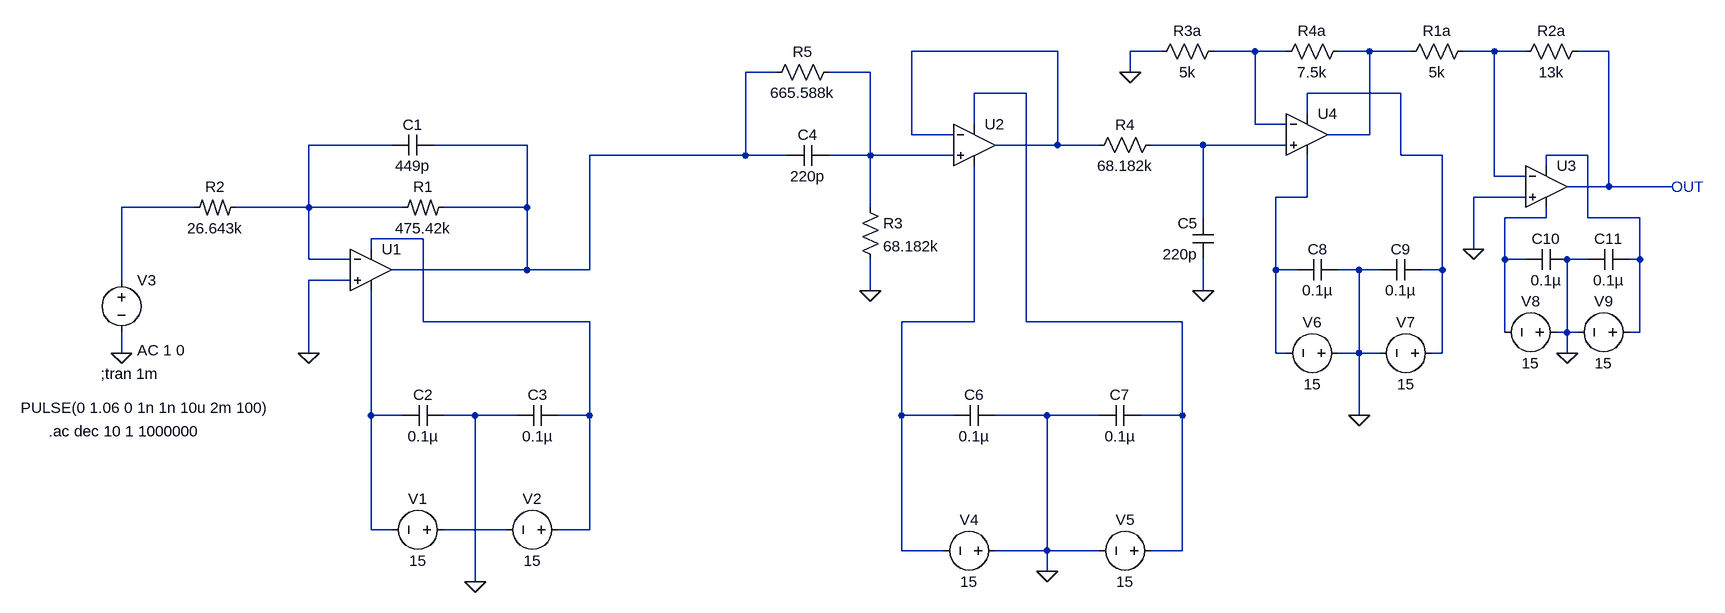
[diagram p0: schematic 4.asc]
4.asc, the LTspice schematic file:
Version 4
SHEET 1 880 680
WIRE -272 -304 -496 -304
WIRE -112 -304 -160 -304
WIRE 32 -304 -32 -304
WIRE 80 -304 32 -304
WIRE 208 -304 160 -304
WIRE 272 -304 208 -304
WIRE 400 -304 352 -304
WIRE 448 -304 400 -304
WIRE 576 -304 528 -304
WIRE -704 -272 -752 -272
WIRE -560 -272 -624 -272
WIRE -160 -272 -160 -304
WIRE -320 -240 -400 -240
WIRE 256 -240 112 -240
WIRE 112 -208 112 -240
WIRE -400 -192 -400 -240
WIRE 32 -192 32 -304
WIRE 80 -192 32 -192
WIRE -496 -176 -496 -304
WIRE -432 -176 -496 -176
WIRE 208 -176 208 -304
WIRE 208 -176 144 -176
WIRE -1296 -160 -1424 -160
WIRE -1088 -160 -1232 -160
WIRE -272 -160 -272 -304
WIRE -272 -160 -368 -160
WIRE -208 -160 -272 -160
WIRE -48 -160 -128 -160
WIRE 80 -160 -48 -160
WIRE -752 -144 -752 -272
WIRE -752 -144 -992 -144
WIRE -688 -144 -752 -144
WIRE -560 -144 -560 -272
WIRE -560 -144 -624 -144
WIRE -432 -144 -560 -144
WIRE 256 -144 256 -240
WIRE 320 -144 256 -144
WIRE 544 -144 480 -144
WIRE 480 -128 480 -144
WIRE 400 -112 400 -304
WIRE 448 -112 400 -112
WIRE 576 -96 576 -304
WIRE 576 -96 512 -96
WIRE 672 -96 576 -96
WIRE 112 -80 112 -144
WIRE 112 -80 64 -80
WIRE 448 -80 368 -80
WIRE -1600 -64 -1712 -64
WIRE -1424 -64 -1424 -160
WIRE -1424 -64 -1536 -64
WIRE -1280 -64 -1424 -64
WIRE -1088 -64 -1088 -160
WIRE -1088 -64 -1216 -64
WIRE -560 -64 -560 -144
WIRE -48 -48 -48 -160
WIRE 480 -48 480 -64
WIRE 480 -48 416 -48
WIRE 544 -48 544 -144
WIRE 624 -48 544 -48
WIRE -1248 -16 -1328 -16
WIRE -1328 0 -1328 -16
WIRE 368 0 368 -80
WIRE -1424 16 -1424 -64
WIRE -1360 16 -1424 16
WIRE 416 16 416 -48
WIRE 448 16 416 16
WIRE 544 16 512 16
WIRE 624 16 624 -48
WIRE 624 16 608 16
WIRE -1088 32 -1088 -64
WIRE -1088 32 -1296 32
WIRE -992 32 -992 -144
WIRE -992 32 -1088 32
WIRE 64 32 64 -80
WIRE 96 32 64 32
WIRE 192 32 160 32
WIRE 224 32 192 32
WIRE 320 32 320 -144
WIRE 320 32 288 32
WIRE -1712 48 -1712 -64
WIRE -1360 48 -1424 48
WIRE -560 64 -560 16
WIRE -48 64 -48 16
WIRE -1248 112 -1248 -16
WIRE -992 112 -1248 112
WIRE -400 112 -400 -128
WIRE -400 112 -512 112
WIRE -320 112 -320 -240
WIRE -80 112 -320 112
WIRE 416 128 416 16
WIRE 512 128 512 16
WIRE 512 128 496 128
WIRE 528 128 512 128
WIRE 624 128 624 16
WIRE 624 128 608 128
WIRE -1712 160 -1712 128
WIRE -1424 160 -1424 48
WIRE 64 160 64 32
WIRE 80 160 64 160
WIRE 192 160 192 32
WIRE 192 160 160 160
WIRE 224 160 192 160
WIRE 320 160 320 32
WIRE 320 160 304 160
WIRE 512 160 512 128
WIRE -1328 256 -1328 64
WIRE -1280 256 -1328 256
WIRE -1168 256 -1216 256
WIRE -1104 256 -1168 256
WIRE -992 256 -992 112
WIRE -992 256 -1040 256
WIRE -512 256 -512 112
WIRE -432 256 -512 256
WIRE -288 256 -368 256
WIRE -208 256 -288 256
WIRE -80 256 -80 112
WIRE -80 256 -144 256
WIRE 192 256 192 160
WIRE -1328 432 -1328 256
WIRE -1296 432 -1328 432
WIRE -1120 432 -1216 432
WIRE -992 432 -992 256
WIRE -992 432 -1040 432
WIRE -512 464 -512 256
WIRE -448 464 -512 464
WIRE -288 464 -288 256
WIRE -288 464 -368 464
WIRE -208 464 -288 464
WIRE -80 464 -80 256
WIRE -80 464 -128 464
WIRE -288 496 -288 464
WIRE -1168 512 -1168 256
FLAG -1712 160 0
FLAG -1424 160 0
FLAG -1168 512 0
FLAG -288 496 0
FLAG -560 64 0
FLAG -48 64 0
FLAG -160 -272 0
FLAG 368 0 0
FLAG 192 256 0
FLAG 512 160 0
SYMBOL Opamps\\UniversalOpamp2 -1328 32 R0
SYMATTR InstName U1
SYMATTR Value2 Avol=0.1Meg GBW=4Meg Slew=13Meg
SYMATTR SpiceLine2 en=0 enk=0 in=0 ink=0 Rin=1T
SYMBOL cap -1232 -176 R90
WINDOW 0 0 32 VBottom 2
WINDOW 3 32 32 VTop 2
SYMATTR InstName C1
SYMATTR Value 449p
SYMBOL res2 -1216 -80 R90
WINDOW 0 0 32 VBottom 2
WINDOW 3 32 32 VTop 2
SYMATTR InstName R1
SYMATTR Value 475.42k
SYMBOL res2 -1536 -80 R90
WINDOW 0 0 32 VBottom 2
WINDOW 3 32 32 VTop 2
SYMATTR InstName R2
SYMATTR Value 26.643k
SYMBOL cap -1216 240 R90
WINDOW 0 0 32 VBottom 2
WINDOW 3 32 32 VTop 2
SYMATTR InstName C2
SYMATTR Value 0.1µ
SYMBOL cap -1040 240 R90
WINDOW 0 0 32 VBottom 2
WINDOW 3 32 32 VTop 2
SYMATTR InstName C3
SYMATTR Value 0.1µ
SYMBOL voltage -1200 432 R90
WINDOW 0 -32 56 VBottom 2
WINDOW 3 32 56 VTop 2
WINDOW 123 0 0 Left 0
WINDOW 39 0 0 Left 0
SYMATTR InstName V1
SYMATTR Value 15
SYMBOL voltage -1024 432 R90
WINDOW 0 -32 56 VBottom 2
WINDOW 3 32 56 VTop 2
WINDOW 123 0 0 Left 0
WINDOW 39 0 0 Left 0
SYMATTR InstName V2
SYMATTR Value 15
SYMBOL voltage -1712 32 R0
WINDOW 123 24 124 Left 2
WINDOW 39 0 0 Left 0
WINDOW 3 -155 212 Left 2
SYMATTR Value2 AC 1 0
SYMATTR Value PULSE(0 1.06 0 1n 1n 10u 2m 100)
SYMATTR InstName V3
SYMBOL cap -624 -160 R90
WINDOW 0 0 32 VBottom 2
WINDOW 3 32 32 VTop 2
SYMATTR InstName C4
SYMATTR Value 220p
SYMBOL cap -32 16 R180
WINDOW 0 24 56 Left 2
WINDOW 3 24 8 Left 2
SYMATTR InstName C5
SYMATTR Value 220p
SYMBOL res -576 -80 R0
SYMATTR InstName R3
SYMATTR Value 68.182k
SYMBOL res -112 -176 R90
WINDOW 0 0 56 VBottom 2
WINDOW 3 32 56 VTop 2
SYMATTR InstName R4
SYMATTR Value 68.182k
SYMBOL Opamps\\UniversalOpamp2 -400 -160 R0
SYMATTR InstName U2
SYMATTR Value2 Avol=0.1Meg GBW=4Meg Slew=13Meg
SYMATTR SpiceLine2 en=0 enk=0 in=0 ink=0 Rin=1T
SYMBOL cap -368 240 R90
WINDOW 0 0 32 VBottom 2
WINDOW 3 32 32 VTop 2
SYMATTR InstName C6
SYMATTR Value 0.1µ
SYMBOL voltage -352 464 R90
WINDOW 0 -32 56 VBottom 2
WINDOW 3 32 56 VTop 2
WINDOW 123 0 0 Left 0
WINDOW 39 0 0 Left 0
SYMATTR InstName V4
SYMATTR Value 15
SYMBOL voltage -112 464 R90
WINDOW 0 -32 56 VBottom 2
WINDOW 3 32 56 VTop 2
WINDOW 123 0 0 Left 0
WINDOW 39 0 0 Left 0
SYMATTR InstName V5
SYMATTR Value 15
SYMBOL cap -144 240 R90
WINDOW 0 0 32 VBottom 2
WINDOW 3 32 32 VTop 2
SYMATTR InstName C7
SYMATTR Value 0.1µ
SYMBOL res -608 -288 R90
WINDOW 0 0 56 VBottom 2
WINDOW 3 32 56 VTop 2
SYMATTR InstName R5
SYMATTR Value 665.588k
SYMBOL Opamps\\UniversalOpamp2 112 -176 R0
SYMATTR InstName U4
SYMATTR Value2 Avol=0.1Meg GBW=4Meg Slew=13Meg
SYMATTR SpiceLine2 en=0 enk=0 in=0 ink=0 Rin=1T
SYMBOL res -16 -320 R90
WINDOW 0 0 56 VBottom 2
WINDOW 3 32 56 VTop 2
SYMATTR InstName R3a
SYMATTR Value 5k
SYMBOL res 176 -320 R90
WINDOW 0 0 56 VBottom 2
WINDOW 3 32 56 VTop 2
SYMATTR InstName R4a
SYMATTR Value 7.5k
SYMBOL res 368 -320 R90
WINDOW 0 0 56 VBottom 2
WINDOW 3 32 56 VTop 2
SYMATTR InstName R1a
SYMATTR Value 5k
SYMBOL res 544 -320 R90
WINDOW 0 0 56 VBottom 2
WINDOW 3 32 56 VTop 2
SYMATTR InstName R2a
SYMATTR Value 13k
SYMBOL Opamps\\UniversalOpamp2 480 -96 R0
SYMATTR InstName U3
SYMATTR Value2 Avol=0.1Meg GBW=4Meg Slew=13Meg
SYMATTR SpiceLine2 en=0 enk=0 in=0 ink=0 Rin=1T
SYMBOL cap 160 16 R90
WINDOW 0 0 32 VBottom 2
WINDOW 3 32 32 VTop 2
SYMATTR InstName C8
SYMATTR Value 0.1µ
SYMBOL cap 288 16 R90
WINDOW 0 0 32 VBottom 2
WINDOW 3 32 32 VTop 2
SYMATTR InstName C9
SYMATTR Value 0.1µ
SYMBOL voltage 176 160 R90
WINDOW 0 -32 56 VBottom 2
WINDOW 3 32 56 VTop 2
SYMATTR InstName V6
SYMATTR Value 15
SYMBOL voltage 320 160 R90
WINDOW 0 -32 56 VBottom 2
WINDOW 3 32 56 VTop 2
SYMATTR InstName V7
SYMATTR Value 15
SYMBOL cap 512 0 R90
WINDOW 0 0 32 VBottom 2
WINDOW 3 32 32 VTop 2
SYMATTR InstName C10
SYMATTR Value 0.1µ
SYMBOL cap 608 0 R90
WINDOW 0 0 32 VBottom 2
WINDOW 3 32 32 VTop 2
SYMATTR InstName C11
SYMATTR Value 0.1µ
SYMBOL voltage 512 128 R90
WINDOW 0 -32 56 VBottom 2
WINDOW 3 32 56 VTop 2
SYMATTR InstName V8
SYMATTR Value 15
SYMBOL voltage 624 128 R90
WINDOW 0 -32 56 VBottom 2
WINDOW 3 32 56 VTop 2
SYMATTR InstName V9
SYMATTR Value 15
TEXT -1744 192 Left 2 !;tran 1m
TEXT -1824 280 Left 2 !.ac dec 10 1 1000000
TEXT 672 -96 Left 2 ;OUT

The netlist it stands for:
* 4.asc
XU1 0 N010 N016 N018 N006 level.2 Avol=0.1Meg GBW=4Meg Slew=13Meg ilimit=25m rail=0 Vos=0 phimargin=45 en=0 enk=0 in=0 ink=0 Rin=1T  ; pins IN+ IN- V+ V- OUT
C1 N006 N010 449p
R1 N006 N010 475.42k
R2 N010 N014 26.643k
C2 0 N018 0.1µ
C3 N016 0 0.1µ
V1 N019 N018 15
V2 N016 N019 15
V3 N014 0 PULSE(0 1.06 0 1n 1n 10u 2m 100) AC 1 0
C4 N007 N006 220p
C5 0 N011 220p
R3 N007 0 68.182k
R4 N011 N001 68.182k
XU2 N007 N001 N008 N017 N001 level.2 Avol=0.1Meg GBW=4Meg Slew=13Meg ilimit=25m rail=0 Vos=0 phimargin=45 en=0 enk=0 in=0 ink=0 Rin=1T  ; pins IN+ IN- V+ V- OUT
C6 0 N017 0.1µ
V4 0 N017 15
V5 N008 0 15
C7 N008 0 0.1µ
R5 N007 N006 665.588k
XU4 N011 N002 N009 N013 N003 level.2 Avol=0.1Meg GBW=4Meg Slew=13Meg ilimit=25m rail=0 Vos=0 phimargin=45 en=0 enk=0 in=0 ink=0 Rin=1T  ; pins IN+ IN- V+ V- OUT
R3a N002 0 5k
R4a N003 N002 7.5k
R1a N004 N003 5k
R2a N005 N004 13k
XU3 0 N004 N012 N015 N005 level.2 Avol=0.1Meg GBW=4Meg Slew=13Meg ilimit=25m rail=0 Vos=0 phimargin=45 en=0 enk=0 in=0 ink=0 Rin=1T  ; pins IN+ IN- V+ V- OUT
C8 0 N013 0.1µ
C9 N009 0 0.1µ
V6 0 N013 15
V7 N009 0 15
C10 0 N015 0.1µ
C11 N012 0 0.1µ
V8 0 N015 15
V9 N012 0 15
;tran 1m
.ac dec 10 1 1000000
* OUT
.lib UniversalOpamps2.sub
.backanno
.end